# Altium schematic sheet RP_ComputeModule3_rev.3.0_Mechanics.SchDoc
size A4 portrait
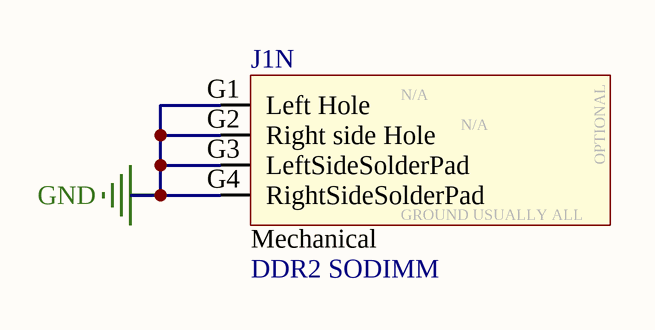
[diagram p0: RP_ComputeModule3_rev.3.0_Mechanics.SchDoc]

## Parts
J1  DDR2 SODIMM  [TE 1473005-4 (DDR2 SO-DIMM)]  (part N of 14)

## Nets
GND: J1.G1(Left_Hole) J1.G2(Right_side_Hole) J1.G3(LeftSideSolderPad) J1.G4(RightSideSolderPad)

## Notes on the sheet
- (in symbol 1473005-4, part N) N/A; OPTIONAL; GROUND USUALLY ALL; Mechanical

## Library data of the parts
J1 = 1473005-4: TE CONNECTIVITY / AMP         1473005-4             SOCKET IC, DIMM, DDR2, 1.8V, 200WAY; Number of Contacts: 200; Memory Type: SDRAM,DDR; Insulation Resistance: 250MR; PCB Mount Retention: With; Gender: Female; Contact Current Rating: 500mA; Circuit Application: Power; Connector System: Cable-to-Board; Sealable: No (Without); Pitch: 0.6mm; Row Spacing: 0.244inch; Stack Height: 5.2mm; Supplier 1: Digi-Key; Manufacturer: TE Connectivity; Manufacturer Part Number: 1473005-4; Stock 1: 3804; Pricing 1: 1=3.9, 10=3.744, 25=3.432, 50=3.276, 100=3.12, 250=2.73, 500=2.652, 1000=2.262, 2500=2.106 (USD); Mount: Surface Mount; Number of Pins: 200; Contact Material: Copper Alloy; Contact Plating: Gold; Housing Colour: Black; Housing Material: Thermoplastic; Insulation Material: Thermoplastic; Min Operating Temperature: -67°C; Max Operating Temperature: 185°C; Number of Rows: 2; Orientation: Right Angle; Termination: Solder; Packaging: Tray; Package Quantity: 20; Number of Positions: 200; Voltage Rating: 1.8V; Connector Type: Socket; Length: 71.5mm; Depth: 26mm; Radiation Hardening: No; ELV: Compliant; Flammability Rating: UL94 V-0; Lead Free: Lead Free; REACH SVHC: No SVHC; ComponentLink1URL: https://datasheet.ciiva.com/682/eng-cd-1473005-j2-682720.pdf; ComponentLink1Description: https://datasheet.ciiva.com/682/eng-cd-1473005-j2-682720.pdf; ComponentLink2URL: https://datasheet.ciiva.com/15171/getdatasheetpartid-99150-15171488.pdf; ComponentLink2Description: https://datasheet.ciiva.com/15171/getdatasheetpartid-99150-15171488.pdf; ComponentLink3URL: https://datasheet.ciiva.com/1105/582309-1105221.pdf; ComponentLink3Description: https://datasheet.ciiva.com/1105/582309-1105221.pdf; ComponentLink4URL: https://datasheet.ciiva.com/682/eng-cd-1473005-j2-682726.pdf; ComponentLink4Description: https://datasheet.ciiva.com/682/eng-cd-1473005-j2-682726.pdf; ComponentLink5URL: https://datasheet.ciiva.com/14156/04821302-14156311.pdf; ComponentLink5Description: https://datasheet.ciiva.com/14156/04821302-14156311.pdf; ComponentLink6URL: https://datasheet.ciiva.com/3136/eng-cd-1473005-j-3136060.pdf; ComponentLink6Description: https://datasheet.ciiva.com/3136/eng-cd-1473005-j-3136060.pdf; ComponentLink7URL: https://datasheet.ciiva.com/16380/eng-cd-1473005-j-16380909.pdf; ComponentLink7Description: https://datasheet.ciiva.com/16380/eng-cd-1473005-j-16380909.pdf; ComponentLink8URL: https://datasheet.ciiva.com/16651/eng-cd-1473005-j-16651646.pdf; ComponentLink8Description: https://datasheet.ciiva.com/16651/eng-cd-1473005-j-16651646.pdf